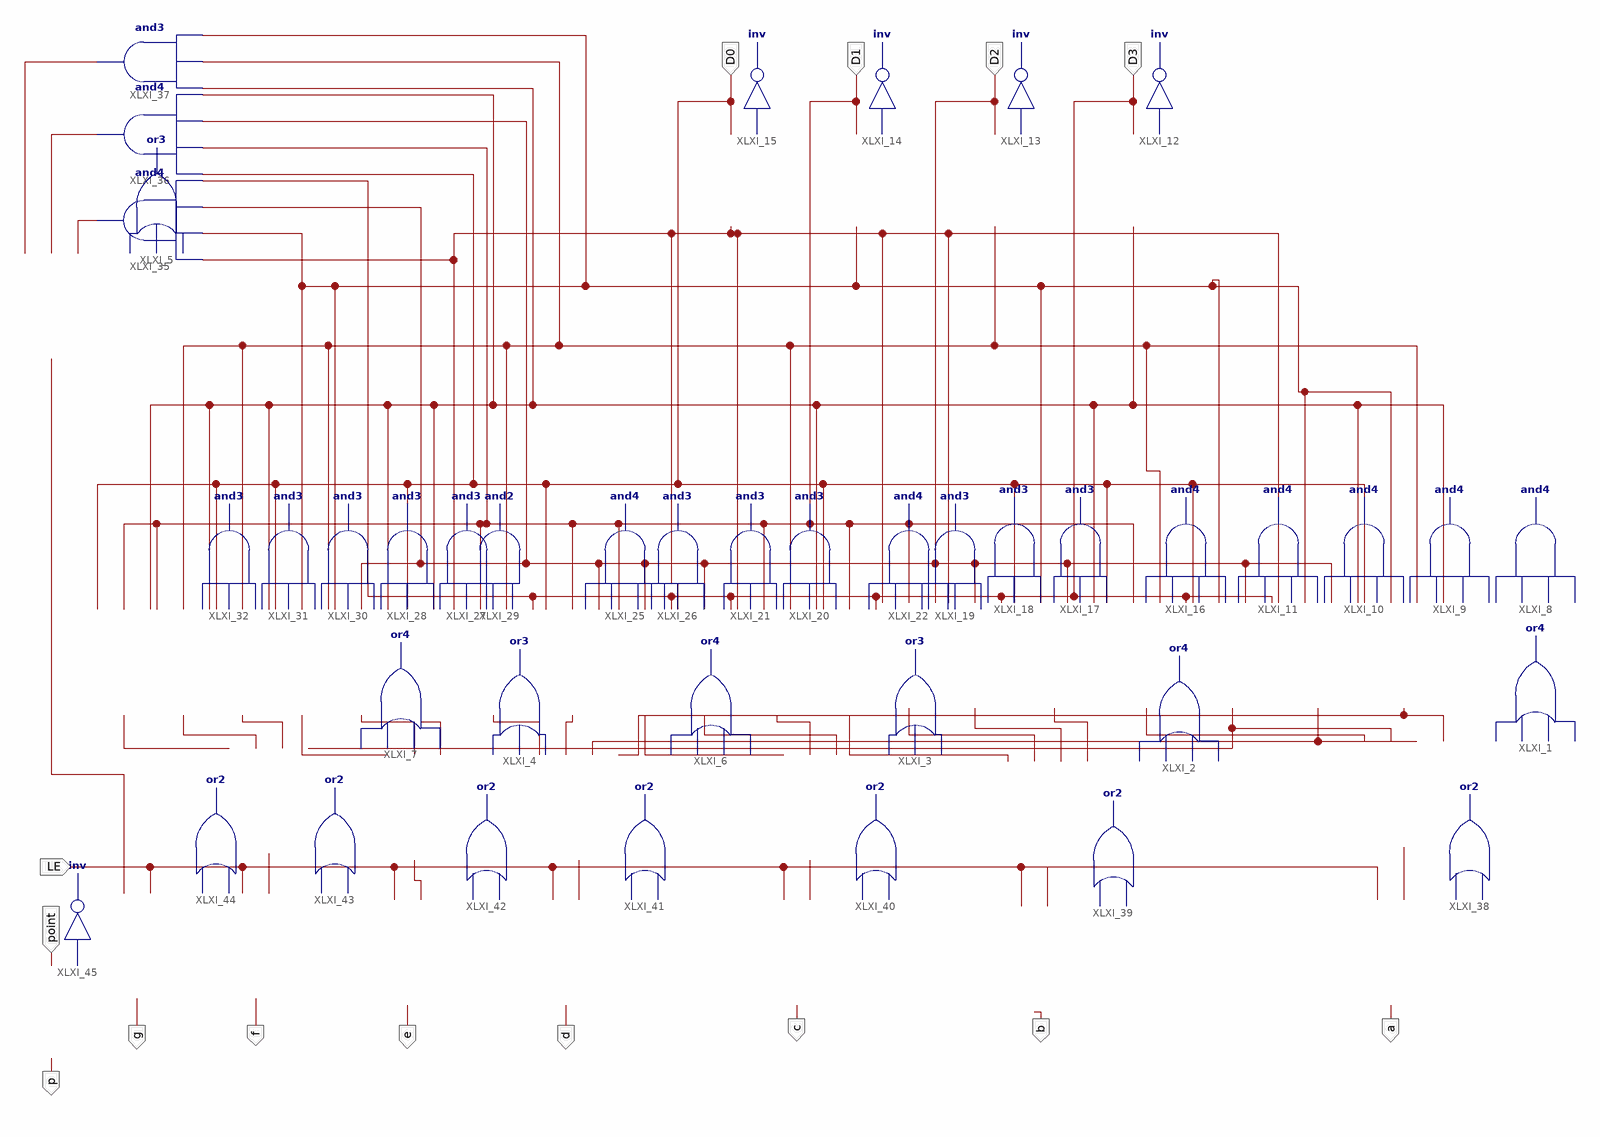
[diagram p0: schematic sheet 1]
// Xilinx ISE schematic MC14495_ZJU.sch (kintex7) as structural Verilog: 41 symbols, 14 ports
module MC14495_ZJU (
  input  D0,
  input  D1,
  input  D2,
  input  D3,
  input  LE,
  input  point,
  output a,
  output b,
  output c,
  output d,
  output e,
  output f,
  output g,
  output p
);

  wire ND0, ND1, ND2, ND3, XLXN_14, XLXN_15, XLXN_16, XLXN_24, XLXN_34, XLXN_73, XLXN_75, XLXN_96, XLXN_117,
       XLXN_118, XLXN_122, XLXN_124, XLXN_125, XLXN_126, XLXN_127, XLXN_128, XLXN_131, XLXN_132, XLXN_133,
       XLXN_136, XLXN_137, XLXN_138, XLXN_159, XLXN_160, XLXN_161, XLXN_162, XLXN_163, XLXN_164, XLXN_165;

  or XLXI_1 (XLXN_159, XLXN_122, XLXN_16, XLXN_15, XLXN_14);
  or XLXI_2 (XLXN_160, XLXN_118, XLXN_117, XLXN_96, XLXN_24);
  or XLXI_3 (XLXN_161, XLXN_73, XLXN_75, XLXN_34);
  or XLXI_4 (XLXN_163, XLXN_126, XLXN_127, XLXN_128);
  or XLXI_5 (XLXN_165, XLXN_136, XLXN_137, XLXN_138);
  or XLXI_6 (XLXN_162, XLXN_122, XLXN_16, XLXN_124, XLXN_125);
  or XLXI_7 (XLXN_164, XLXN_15, XLXN_131, XLXN_132, XLXN_133);
  and XLXI_8 (XLXN_122, ND3, ND2, ND1, D0);
  and XLXI_9 (XLXN_16, ND3, D2, ND1, ND0);
  and XLXI_10 (XLXN_15, D3, D2, ND1, D0);
  and XLXI_11 (XLXN_14, D3, ND2, D1, D0);
  not XLXI_12 (ND3, D3);
  not XLXI_13 (ND2, D2);
  not XLXI_14 (ND1, D1);
  not XLXI_15 (ND0, D0);
  and XLXI_16 (XLXN_118, ND3, D2, ND1, D0);
  and XLXI_17 (XLXN_117, D3, D2, ND0);
  and XLXI_18 (XLXN_96, D2, D1, ND0);
  and XLXI_19 (XLXN_24, D3, D1, D0);
  and XLXI_20 (XLXN_73, D3, D2, ND0);
  and XLXI_21 (XLXN_34, D3, D2, D1);
  and XLXI_22 (XLXN_75, ND3, ND2, D1, ND0);
  and XLXI_25 (XLXN_125, D3, ND2, D1, ND0);
  and XLXI_26 (XLXN_124, D2, D1, D0);
  and XLXI_27 (XLXN_127, ND3, D2, ND1);
  and XLXI_28 (XLXN_128, ND2, ND1, D0);
  and XLXI_29 (XLXN_126, ND3, D0);
  and XLXI_30 (XLXN_131, ND3, ND2, D0);
  and XLXI_31 (XLXN_132, ND3, ND2, D1);
  and XLXI_32 (XLXN_133, ND3, D1, D0);
  and XLXI_35 (XLXN_136, ND0, ND1, D2, D3);
  and XLXI_36 (XLXN_137, ND3, D2, D1, D0);
  and XLXI_37 (XLXN_138, ND1, ND2, ND3);
  or XLXI_38 (a, XLXN_159, LE);
  or XLXI_39 (b, XLXN_160, LE);
  or XLXI_40 (c, XLXN_161, LE);
  or XLXI_41 (d, XLXN_162, LE);
  or XLXI_42 (e, XLXN_163, LE);
  or XLXI_43 (f, XLXN_164, LE);
  or XLXI_44 (g, LE, XLXN_165);
  not XLXI_45 (p, point);
endmodule
